# EAGLE design Hormiga_877_CH340G_Rev_C (EAGLE 9.6.2)

## Sheet 1 of 2: Main Board
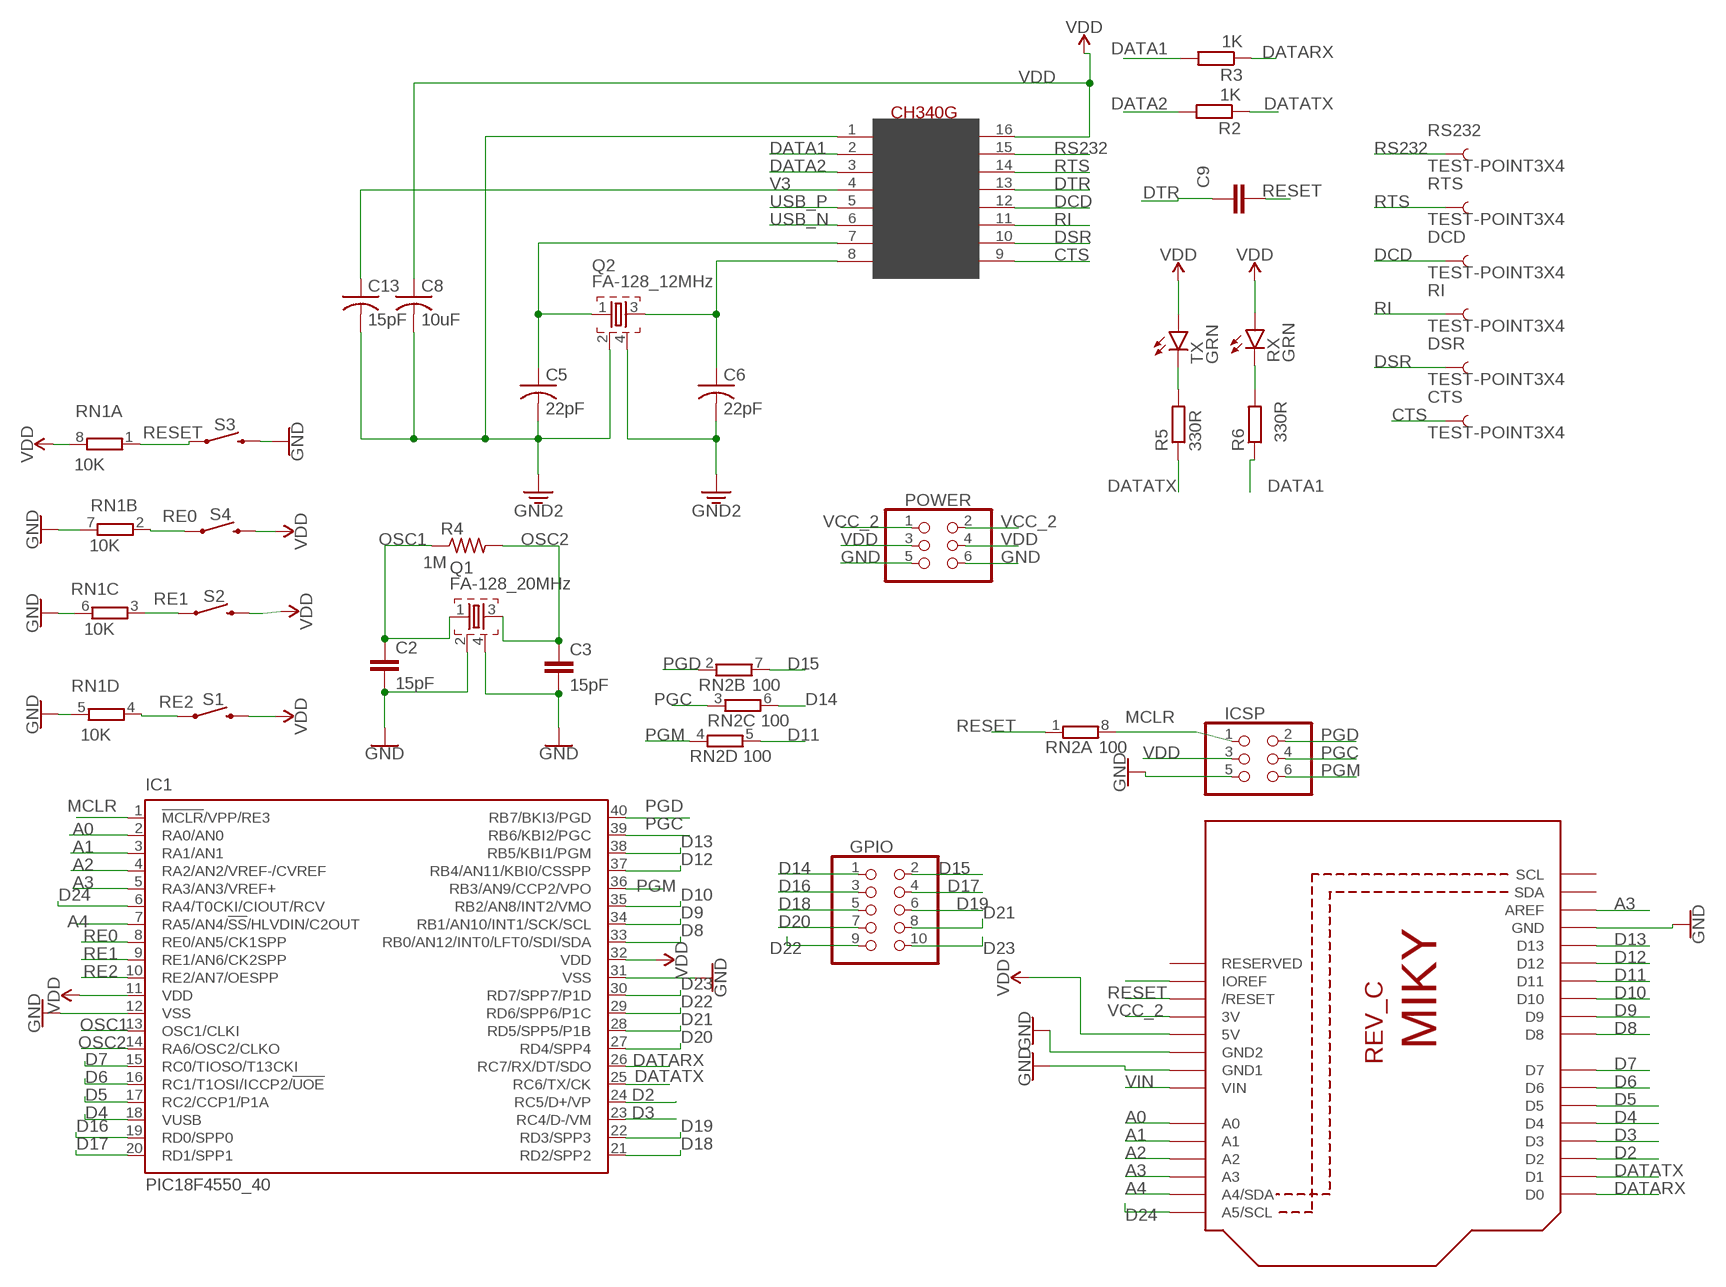
[diagram p0: schematic, sheet 1]

### Parts
C2  15pF  15PF-0402-50V-5%  [0402]
C3  15pF  15PF-0402-50V-5%  [0402]
C5  22pF  C-USC0603  [C0603]
C6  22pF  C-USC0603  [C0603]
C8  10uF  C-USC0603  [C0603]
C9  0.1uF  C-EUC0603  [C0603]
C13  15pF  C-USC0603  [C0603]
CTS  TEST-POINT3X4  [PAD.03X.04]
DCD  TEST-POINT3X4  [PAD.03X.04]
DSR  TEST-POINT3X4  [PAD.03X.04]
GPIO  PINHD-2X5  [2X05]
IC1  PIC18F4550_40  [DIL40]
ICSP  icsp  PINHD-2X3  [2X03]
POWER  POWER  PINHD-2X3  [2X03]
Q1  FA-128_20MHz  FA-128  [FA-128]
Q2  FA-128_12MHz  FA-128  [FA-128]
R2  1K  R-EU_R0805  [R0805]
R3  1K  R-EU_R0805  [R0805]
R4  1M  R-US_R0603  [R0603]
R5  330R  R-EU_R0805  [R0805]
R6  330R  R-EU_R0805  [R0805]
RI  TEST-POINT3X4  [PAD.03X.04]
RN1  10K  4R-N0603-ARC  [0603-ARC]
RN2  100  4R-N0603-ARC  [0603-ARC]
RS232  TEST-POINT3X4  [PAD.03X.04]
RTS  TEST-POINT3X4  [PAD.03X.04]
RX  GRN  LEDCHIP-LED0603  [CHIP-LED0603]
S1  MOMENTARY-SWITCH-SPST-SMD-5.2-REDUNDANT  [TACTILE_SWITCH_SMD_5.2MM]
S2  MOMENTARY-SWITCH-SPST-SMD-5.2-REDUNDANT  [TACTILE_SWITCH_SMD_5.2MM]
S3  MOMENTARY-SWITCH-SPST-SMD-5.2-REDUNDANT  [TACTILE_SWITCH_SMD_5.2MM]
S4  MOMENTARY-SWITCH-SPST-SMD-5.2-REDUNDANT  [TACTILE_SWITCH_SMD_5.2MM]
TX  GRN  LEDCHIP-LED0603  [CHIP-LED0603]
U2  ARDUINOR3-DIMENSION  [ARDUINOR3]
U$1  CH340G  [SOIC16]

### Nets
A0 [SIGNAL3V3]: IC1.2(RA0/AN0) U2.A0
A1 [SIGNAL3V3]: IC1.3(RA1/AN1) U2.A1
A2 [SIGNAL3V3]: IC1.4(RA2/AN2/VREF-/CVREF) U2.A2
A3 [SIGNAL3V3]: IC1.5(RA3/AN3/VREF+) U2.A3 U2.AREF
A4: IC1.7(RA5/AN4/!SS!/HLVDIN/C2OUT) U2.A4(A4/SDA)
CTS: CTS.P$1 U$1.9(CTS)
D2 [SIGNAL3V3]: IC1.24(RC5/D+/VP) U2.D2
D3 [SIGNAL3V3]: IC1.23(RC4/D-/VM) U2.D3
D4 [SIGNAL3V3]: IC1.18(VUSB) U2.D4
D5: IC1.17(RC2/CCP1/P1A) U2.D5
D6 [SIGNAL3V3]: IC1.16(RC1/T1OSI/ICCP2/!UOE) U2.D6
D7 [SIGNAL3V3]: IC1.15(RC0/TIOSO/T13CKI) U2.D7
D8: IC1.33(RB0/AN12/INT0/LFT0/SDI/SDA) U2.D8
D9: IC1.34(RB1/AN10/INT1/SCK/SCL) U2.D9
D10: IC1.35(RB2/AN8/INT2/VMO) U2.D10
D11: RN2.5 U2.D11
D12 [SIGNAL3V3]: IC1.37(RB4/AN11/KBI0/CSSPP) U2.D12
D13 [SIGNAL3V3]: IC1.38(RB5/KBI1/PGM) U2.D13 ; also sheet 2
D14 [SIGNAL3V3]: GPIO.1 RN2.6
D15 [SIGNAL3V3]: GPIO.2 RN2.7
D16: GPIO.3 IC1.19(RD0/SPP0)
D17 [SIGNAL3V3]: GPIO.4 IC1.20(RD1/SPP1)
D18: GPIO.5 IC1.21(RD2/SPP2)
D19 [SIGNAL3V3]: GPIO.6 IC1.22(RD3/SPP3)
D20 [SIGNAL3V3]: GPIO.7 IC1.27(RD4/SPP4)
D21 [SIGNAL3V3]: GPIO.8 IC1.28(RD5/SPP5/P1B)
D22 [SIGNAL3V3]: GPIO.9 IC1.29(RD6/SPP6/P1C)
D23: GPIO.10 IC1.30(RD7/SPP7/P1D)
D24 [SIGNAL3V3]: IC1.6(RA4/T0CKI/CIOUT/RCV) U2.A5(A5/SCL)
DATA1: R3.2 R6.1 U$1.2(TX)
DATA2: R2.2 U$1.3(RX)
DATARX [SIGNAL3V3]: IC1.26(RC7/RX/DT/SDO) R3.1 U2.D0
DATATX [SIGNAL3V3]: IC1.25(RC6/TX/CK) R2.1 R5.1 U2.D1
DCD: DCD.P$1 U$1.12(DCD)
DSR: DSR.P$1 U$1.10(DSR)
DTR: C9.1 U$1.13(DTR)
GND [SIGNALPIC]: C2.2 C3.2 C5.2 C6.2 C8.2 C13.2 IC1.12(VSS) IC1.31(VSS) ICSP.5 POWER.5 POWER.6 Q1.2 Q1.4 Q2.2 Q2.4 RN1.5 RN1.6 RN1.7 S3.3 S3.4 U2.GND U2.GND1 U2.GND2 U$1.1(GND) ; supply symbol labelled GND2 ; also sheet 2
LEDRX: R6.2 RX.C
LEDTX: R5.2 TX.C
MCLR: IC1.1(!MCLR!/VPP/RE3) ICSP.1 RN2.8
N$6: U2.IOREF
OSC1 [SIGNAL3V3]: C2.1 IC1.13(OSC1/CLKI) Q1.1 R4.1
OSC2 [SIGNAL3V3]: C3.1 IC1.14(RA6/OSC2/CLKO) Q1.3 R4.2
PGC [SIGNAL3V3]: IC1.39(RB6/KBI2/PGC) ICSP.4 RN2.3
PGD [SIGNAL3V3]: IC1.40(RB7/BKI3/PGD) ICSP.2 RN2.2
PGM: IC1.36(RB3/AN9/CCP2/VPO) ICSP.6 RN2.4
RE0: IC1.8(RE0/AN5/CK1SPP) RN1.2 S4.1 S4.2
RE1: IC1.9(RE1/AN6/CK2SPP) RN1.3 S2.1 S2.2
RE2: IC1.10(RE2/AN7/OESPP) RN1.4 S1.1 S1.2
RESET [SIGNAL3V3]: C9.2 RN1.1 RN2.1 S3.1 S3.2 U2.RESET(/RESET)
RI: RI.P$1 U$1.11(RI)
RS232: RS232.P$1 U$1.15(RS232)
RTS: RTS.P$1 U$1.14(RTS)
USB_N: U$1.6(D-) ; also sheet 2
USB_P: U$1.5(D+) ; also sheet 2
V3: C13.1 U$1.4(V3)
VCC_2 [SIGNAL3V3]: POWER.1 POWER.2 U2.3V ; also sheet 2
VDD: C8.1 IC1.11(VDD) IC1.32(VDD) ICSP.3 POWER.3 POWER.4 RN1.8 RX.A S1.3 S1.4 S2.3 S2.4 S4.3 S4.4 TX.A U2.5V U$1.16(VCC) ; also sheet 2
VIN [SIGNAL3V3]: U2.VIN ; also sheet 2
XI: C5.1 Q2.1 U$1.7(XI)
XO: C6.1 Q2.3 U$1.8(XO)
Unconnected: U2.RESERVED U2.SCL U2.SDA

## Sheet 2 of 2: Power_Supply
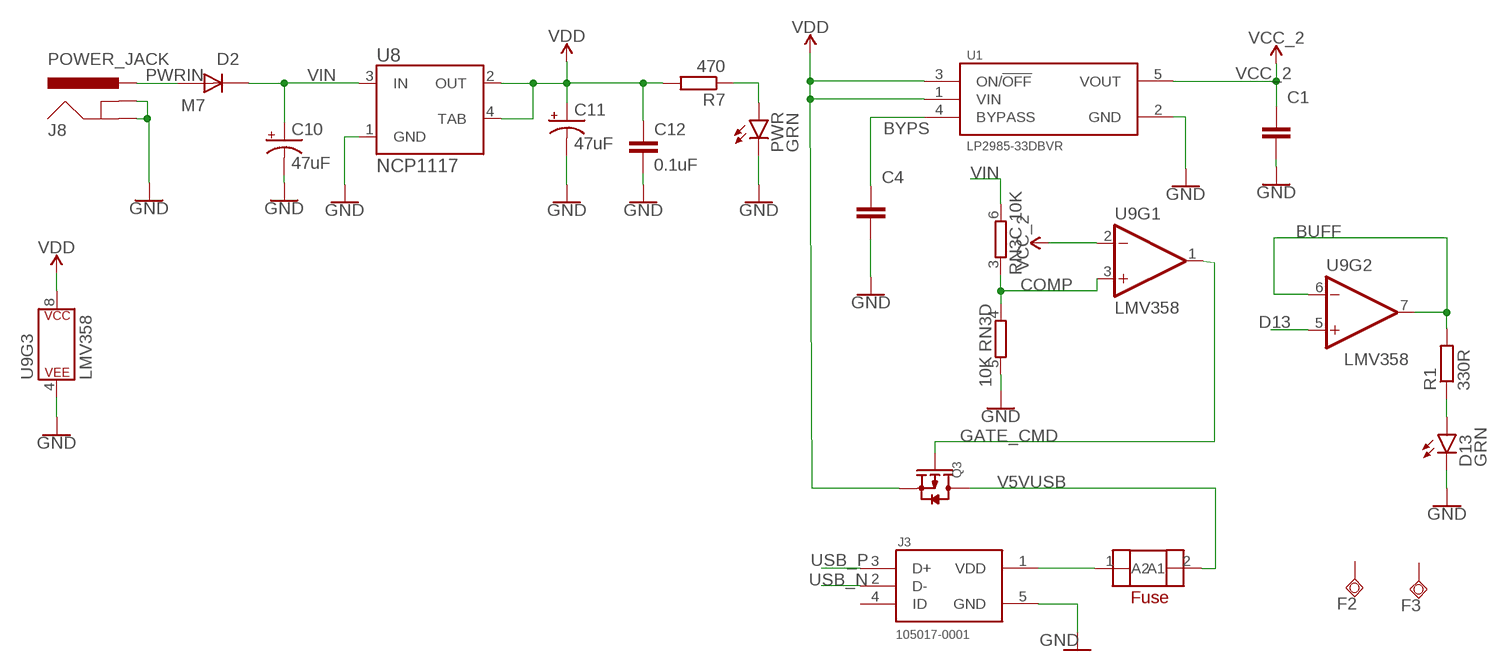
[diagram p1: schematic, sheet 2]

### Parts
C1  1.0uF  C-EUC0603  [C0603]
C4  10nF  C-EUC0603  [C0603]
C10  47uF  47UF-POLAR-PANASONIC_D-35V-20%  [PANASONIC_D]
C11  47uF  47UF-POLAR-PANASONIC_D-35V-20%  [PANASONIC_D]
C12  0.1uF  0.1UF-0402-16V-10%  [0402]
D2  M7  [DIOM505270X240]
D13  GRN  LEDCHIP-LED0603  [CHIP-LED0603]
F2  TPSQTP10R  [TP10R]
F3  TPSQTP10R  [TP10R]
FUSE  FUSE0603  [R0603]
J3  105017-0001  [MOLEX_105017-0001]
J8  POWER_JACK  [POWER_JACK_PTH]
PWR  GRN  LEDCHIP-LED0603  [CHIP-LED0603]
Q3  SMD-MOSFET-P-CH-20V-2A(SOT-23)  [SOT-23]
R1  330R  R-EU_R0805  [R0805]
R7  470  R-EU_R0805  [R0805]
RN3  10K  4R-N0603-ARC  [0603-ARC]
U1  LP2985-33DBVR  [SOT95P280X145-5N]
U8  NCP1117  [SOT223]
U9  LMV358  LMV358SOIC  [SO08]

### Nets
BUFF [SIGNAL3V3]: R1.2 U9.6(-IN) U9.7(OUT)
BYPS: C4.1 U1.4(BYPASS)
COMP: RN3.3 RN3.4 U9.3(+IN)
D13 [SIGNAL3V3]: U9.5(+IN) ; also sheet 1
D13LED [SIGNALPIC]: D13.A R1.1
FUSE: FUSE.1(A1) J3.1(VDD)
GATE_CMD [SIGNAL]: Q3.1(G) U9.1(OUT)
GND [SIGNALPIC]: C1.2 C4.2 C10.- C11.- C12.2 D13.C J3.5(GND) J8.GND J8.GNDBREAK PWR.C RN3.5 U1.2(GND) U8.1(GND) U9.4(P$V-) ; also sheet 1
ONLED [SIGNALPIC]: PWR.A R7.1
PWRIN [SIGNALPIC]: D2.A J8.PWR
USB_N: J3.2(D-) ; also sheet 1
USB_P: J3.3(D+) ; also sheet 1
V5VUSB: FUSE.2(A2) Q3.3(D)
VCC_2 [SIGNAL3V3]: C1.1 U1.5(VOUT) U9.2(-IN) ; also sheet 1
VDD: C11.+ C12.1 Q3.2(S) R7.2 U1.1(VIN) U1.3(ON/!OFF) U8.2(OUT) U8.4(TAB) U9.8(P$V+) ; also sheet 1
VIN [SIGNAL3V3]: C10.+ D2.C RN3.6 U8.3(IN) ; also sheet 1
Unconnected: F2.TP F3.TP J3.4(ID) RN3.1 RN3.2 RN3.7 RN3.8

## Library data of the parts
C1 = rcl:C-EU: CAPACITOR, European symbol; MPN: C1608X5R1E105K080AC; OC_NEWARK: 90R7677; SPICEPREFIX: C
C2 C3 = SparkFun-Capacitors:15PF: 15pF ceramic capacitors A capacitor is a passive two-terminal electrical component used to store electrical energy temporarily in an electric field.; MF: FARNELL; MPN: CC0402JRNPO9BN150; OC_NEWARK: 69C9582; PROD_ID: CAP-13063
C4 = rcl:C-EU: CAPACITOR, European symbol; MPN: C0603C103K1RACTU; OC_NEWARK: 29T8974; SPICEPREFIX: C
C5 C6 C8 C13 = rcl:C-US: CAPACITOR, American symbol; SPICEPREFIX: C
C9 = rcl:C-EU: CAPACITOR, European symbol; MPN: C0603C103J1RACTU; OC_NEWARK: 07X0751; SPICEPREFIX: C
C10 C11 = SparkFun-Capacitors:47UF-POLAR: 47µF polarized capacitors A capacitor is a passive two-terminal electrical component used to store electrical energy temporarily in an electric field.; MPN: EEE-1CA470WR; OC_NEWARK: 53W3779; PROD_ID: CAP-08478
C12 = SparkFun-Capacitors:0.1UF: 0.1µF ceramic capacitors A capacitor is a passive two-terminal electrical component used to store electrical energy temporarily in an electric field.; MPN: C0603C103J1RACTU; OC_NEWARK: 07X0751; PROD_ID: CAP-12416
CTS DCD DSR RI RS232 RTS = SparkFun-Connectors:TEST-POINT: SparkFun Test Points Bare copper test points for troubleshooting or In-Circuit-Testing. These are used by our Production team for verifying production board runs using pogo-pins on test beds. SparkFun Products: SparkFun LSM9DS1 Breakout <https://www.sparkfun.com/products/13284> SparkFun PSOC <https://www.sparkfun.com/products/13714> SparkFun Load Cell Amplifier <https://www.sparkfun.com/products/13879>
D2 = Tonche_Library:M7: none; AVAILABILITY: Unavailable; MP: M7; MPN: RFN1LAM7STFTR; OC_NEWARK: 58AC3694; PACKAGE: DO-214 Diodes Inc.; PRICE: 0.01 USD
D13 PWR RX TX = led:LED: LED OSRAM: - CHIPLED LG R971, LG N971, LY N971, LG Q971, LY Q971, LO R971, LY R971 LH N974, LH R974 LS Q976, LO Q976, LY Q976 LO Q996 - Hyper CHIPLED LW Q18S LB Q993, LB Q99A, LB R99A - SideLED LS A670, LO A670, LY A670, LG A670, LP A670 LB A673, LV A673, LT A673, LW A673 LH A674 LY A675 LS A676, LA A676, LO A676, LY A676, LW A676 LS A679, LY A679, LG A679 - Hyper Micro SIDELED® LS Y876, LA Y876, LO Y876, LY Y876 LT Y87S - SmartLED LW L88C, LW L88S LB L89C, LB L89S, LG L890 LS L89K, LO L89K, LY L89K LS L896, LA L896, LO L896, LY L896 - TOPLED LS T670, LO T670, LY T670, LG T670, LP T670 LSG T670, LSP T670, LSY T670, LOP T670, LYG T670 LG T671, LOG T671, LSG T671 LB T673, LV T673, LT T673, LW T673 LH T674 LS T676, LA T676, LO T676, LY T676, LB T676, LH T676, LSB T676, LW T676 LB T67C, LV T67C, LT T67C, LS T67K, LO T67K, LY T67K, LW E67C LS E67B, LA E67B, LO E67B, LY E67B, LB E67C, LV E67C, LT E67C LW T67C LS T679, LY T679, LG T679 LS T770, LO T770, LY T770, LG T770, LP T770 LB T773, LV T773, LT T773, LW T773 LH T774 LS E675, LA E675, LY E675, LS T675 LS T776, LA T776, LO T776, LY T776, LB T776 LHGB T686 LT T68C, LB T68C - Hyper Mini TOPLED® LB M676 - Mini TOPLED Santana® LG M470 LS M47K, LO M47K, LY M47K Source: http://www.osram.convergy.de LUXEON: - LUMILED® LXK2-PW12-R00, LXK2-PW12-S00, LXK2-PW14-U00, LXK2-PW14-V00 LXK2-PM12-R00, LXK2-PM12-S00, LXK2-PM14-U00 LXK2-PE12-Q00, LXK2-PE12-R00, LXK2-PE12-S00, LXK2-PE14-T00, LXK2-PE14-U00 LXK2-PB12-K00, LXK2-PB12-L00, LXK2-PB12-M00, LXK2-PB14-N00, LXK2-PB14-P00, LXK2-PB14-Q00 LXK2-PR12-L00, LXK2-PR12-M00, LXK2-PR14-Q00, LXK2-PR14-R00 LXK2-PD12-Q00, LXK2-PD12-R00, LXK2-PD12-S00 LXK2-PH12-R00, LXK2-PH12-S00 LXK2-PL12-P00, LXK2-PL12-Q00, LXK2-PL12-R00 Source: www.luxeon.com KINGBRIGHT: KA-3528ASYC Source: www.kingbright.com; MPN: HSME-C191; OC_NEWARK: 05M0345
F2 F3 = testpad:TPSQ: Test pad
FUSE = Tonche_Library:FUSE0603
GPIO = pinhead:PINHD-2X5: PIN HEADER
IC1 = microchip:PIC18F4*_40: USB Microcontrollers with nanoWatt Technology High-Performance, Enhanced Flash, 28/40/44-Pin, Source: http://ww1.microchip.com/downloads/en/devicedoc/39632c.pdf; MF: MICROCHIP; MPN: PIC18F4550-I/P; OC_FARNELL: 9321357; OC_NEWARK: 74K8623
ICSP POWER = pinhead:PINHD-2X3: PIN HEADER
J3 = MICRO-B_MOLEX_105017-0001:105017-0001; AVAILABILITY: Unavailable; DESCRIPTION: Conn USB Type B M 5 POS 0.65mm Solder RA Thru-Hole 5 Terminal 1 Port Embossed T/R; MF: Molex; MP: 105017-0001; PACKAGE: None; PRICE: None
J8 = SparkFun-Connectors:POWER_JACK: Power Jack Connector This is the standard 5.5mm barrel jack for power. The PTH is the most common, proven, reliable, footprint. The Slot footprint only works if the mill layer is transmitted to the PCB fab house so be warned. Here are the connectors we sell at SparkFun: DC Barrel Power Jack/Connector <https://www.sparkfun.com/products/119> (PRT-00119) DC Barrel Power Jack/Connector (SMD) <https://www.sparkfun.com/products/12748> (PRT-12748) DC Barrel Jack Adapter - Breadboard Compatible <https://www.sparkfun.com/products/10811> (PRT-10811) It is used on this SparkFun product (and many, many others): SparkFun RedBoard - Programmed with Arduino <https://www.sparkfun.com/products/12757> (DEV-12757) Also, if you need a mating power supply or connector, please check these out: Wall Adapter Power Supply - 9VDC 650mA <https://www.sparkfun.com/products/298> (TOL-00298) DC Barrel Jack Adapter - Male <https://www.sparkfun.com/products/10287> (PRT-10287); MPN: FC681465P; OC_NEWARK: 20T2054; PROD_ID: CONN-08197
Q1 Q2 = crystal:FA-: MHz RANGE CRYSTAL UNIT Source: Epson Toyocom
Q3 = SMD-MOSFET-P-CH-20V-2A_SOT-23_:SMD-MOSFET-P-CH-20V-2A(SOT-23): 305030026; AVAILABILITY: Good; DESCRIPTION: Single P-Channel 20V 70 mOhm Logic Level PowerTrench Mosfet SSOT-3; MF: FAIRCHILD SEMICONDUCTOR; MP: FDN340P; MPN: FDN340P; OC_NEWARK: 58K8841; PACKAGE: SC-59 ON Semiconductor; PRICE: 0.19 USD
R1 R5 R6 = rcl:R-EU_: RESISTOR, European symbol; MPN: ERJ-6GEYJ331V; OC_NEWARK: 65T8817; SPICEPREFIX: R
R2 R3 = rcl:R-EU_: RESISTOR, European symbol; MPN: EXB-V8V103JV; OC_NEWARK: 65T8998; SPICEPREFIX: R
R4 = Arduino Modificable_2:R-US_: RESISTOR, American symbol
R7 = rcl:R-EU_: RESISTOR, European symbol; MPN: ERJ-6GEYJ471V; OC_NEWARK: 65T8826; SPICEPREFIX: R
RN1 RN3 = resistor-dil:4R-N: Array Chip Resistor Source: RS Component / Phycomp; MPN: EXB-V8V103JV; OC_FARNELL: unknown; OC_NEWARK: 65T8998
RN2 = resistor-dil:4R-N: Array Chip Resistor Source: RS Component / Phycomp; OC_FARNELL: unknown; OC_NEWARK: unknown
S1-S4 = SparkFun-Switches:MOMENTARY-SWITCH-SPST: Momentary Switch (Pushbutton) - SPST Normally-open (NO) SPST momentary switches (buttons, pushbuttons). Variants PTH-12MM - 12mm square, through-hole Momentary Pushbutton Switch - 12mm Square <https://www.sparkfun.com/products/9190> (COM-09190) PTH-6.0MM, PTH-6.0MM-KIT - 6.0mm square, through-hole Mini Pushbutton Switch <https://www.sparkfun.com/products/97> (COM-00097) KIT package intended for soldering kit's - only one side of pads' copper is exposed. PTH-RIGHT-ANGLE-KIT - Right-angle, through-hole Right Angle Tactile Button <https://www.sparkfun.com/products/10791> - Used on SparkFun BigTime Watch Kit <https://www.sparkfun.com/products/11734> SMD-12MM - 12mm square, surface-mount Tactile Button - SMD (12mm) <https://www.sparkfun.com/products/12993> (COM-12993) Used on SparkFun PicoBoard <https://www.sparkfun.com/products/11888> SMD-4.5MM - 4.5mm Square Trackball Switch Used on SparkFun Blackberry Trackballer Breakout <https://www.sparkfun.com/products/13169> SMD-4.6MMX2.8MM - 4.60mm x 2.80mm, surface mount Used on SparkFun SAMD21 Mini Breakout <https://www.sparkfun.com/products/13664> SMD-5.2MM, SMD-5.2-REDUNDANT - 5.2mm square, surface-mount Mini Pushbutton Switch - SMD <https://www.sparkfun.com/products/8720> (COM-08720) Used on Arduino Pro Mini <https://www.sparkfun.com/products/11114> REDUNDANT package connects both switch circuits together SMD-6.0X3.5MM - 6.0 x 3.5mm, surface mount Momentary Reset Switch SMD <https://www.sparkfun.com/products/8229> (COM-08229) SMD-6.2MM-TALL - 6.2mm square, surface mount Tactile Button - SMD (6mm) <https://www.sparkfun.com/products/12992> Used on SparkFun Digital Sandbox <https://www.sparkfun.com/products/12651> SMD-RIGHT-ANGLE - Right-angle, surface mount Used on SparkFun Block for Intel® Edison - Arduino <https://www.sparkfun.com/products/13036>; MPN: TL3301AF160QG; OC_NEWARK: 15N4497; PROD_ID: SWCH-08247; SF_SKU: COM-08720
U1 = LP2985-33DBVR:LP2985-33DBVR: LP2985 150-mA Low-noise Low-dropout Regulator With Shutdown; AVAILABILITY: Good; DESCRIPTION: Single Output LDO, 150mA, Fixed_3.3V_, 1.5% Tolerance, Low Quiescent Current, Low Noise 5-SOT-23 -40 to 125; MF: TEXAS INSTRUMENTS; MP: LP2985-33DBVR; MPN: LP2985-33DBVR; OC_NEWARK: 43J9346; PACKAGE: SOT-23-5 Texas Instruments; PRICE: 0.39 USD
U2 = Arduino Modificable_2:ARDUINOR3: This is a new object for the new Arduino R3 - with extra pins that you may want to use (such as IOref, and duplicated A4/A5
U8 = NCP1117:NCP1117: Check availability <https://pricing.snapeda.com/parts/NCP1117/ON%20Semiconductor/view-part?ref=eda>; AVAILABILITY: In Stock; DESCRIPTION: Linear Voltage Regulator IC Positive Fixed 1 Output 1A SOT-223; MF: ON SEMICONDUCTOR; MP: NCP1117; MPN: NCP1117ST50T3G; OC_NEWARK: 71J6563; PACKAGE: None; PRICE: None
U9 = SparkFun-IC-Amplifiers:LMV358: IC LMV358 DUAL OP AMP Jellybean rail-to-rail output op-amp SparkFun Products SparkFun PicoBoard <https://www.sparkfun.com/products/11888> (WIG-11888) SparkFun Vernier Interface Shield <https://www.sparkfun.com/products/12858> (DEV-12858) SparkFun Blynk Board - ESP8266 <https://www.sparkfun.com/products/13794> (WRL-13794) SparkFun Digital Sandbox <https://www.sparkfun.com/products/12651> (DEV-12651 RoHS); MF: FAIRCHILD SEMICONDUCTOR; MPN: LMV358AM8X; OC_NEWARK: 29H0537; PROD_ID: IC-09657
U$1 = CH340G:CH340G: Check availability <https://pricing.snapeda.com/parts/CH340G/Olimex/view-part?ref=eda>; AVAILABILITY: Not in stock; DESCRIPTION: IC-340 USB INTERFACE SO16; MF: Olimex; MP: CH340G; PACKAGE: None; PRICE: None

## Net classes
0 USBUART: width 0.3 mm, clearance 0.1 mm
1 SIGNAL: width 0.53 mm, clearance 0.3 mm
2 3V3: width 0.35 mm, clearance 0.006 mm
3 SIGNALPIC: width 0.53 mm, clearance 0.008 mm
4 SIGNAL3V3: width 0.35 mm, clearance 0.15 mm
5 LEDUSART: width 0.1 mm, clearance 0.003 mm

## Board
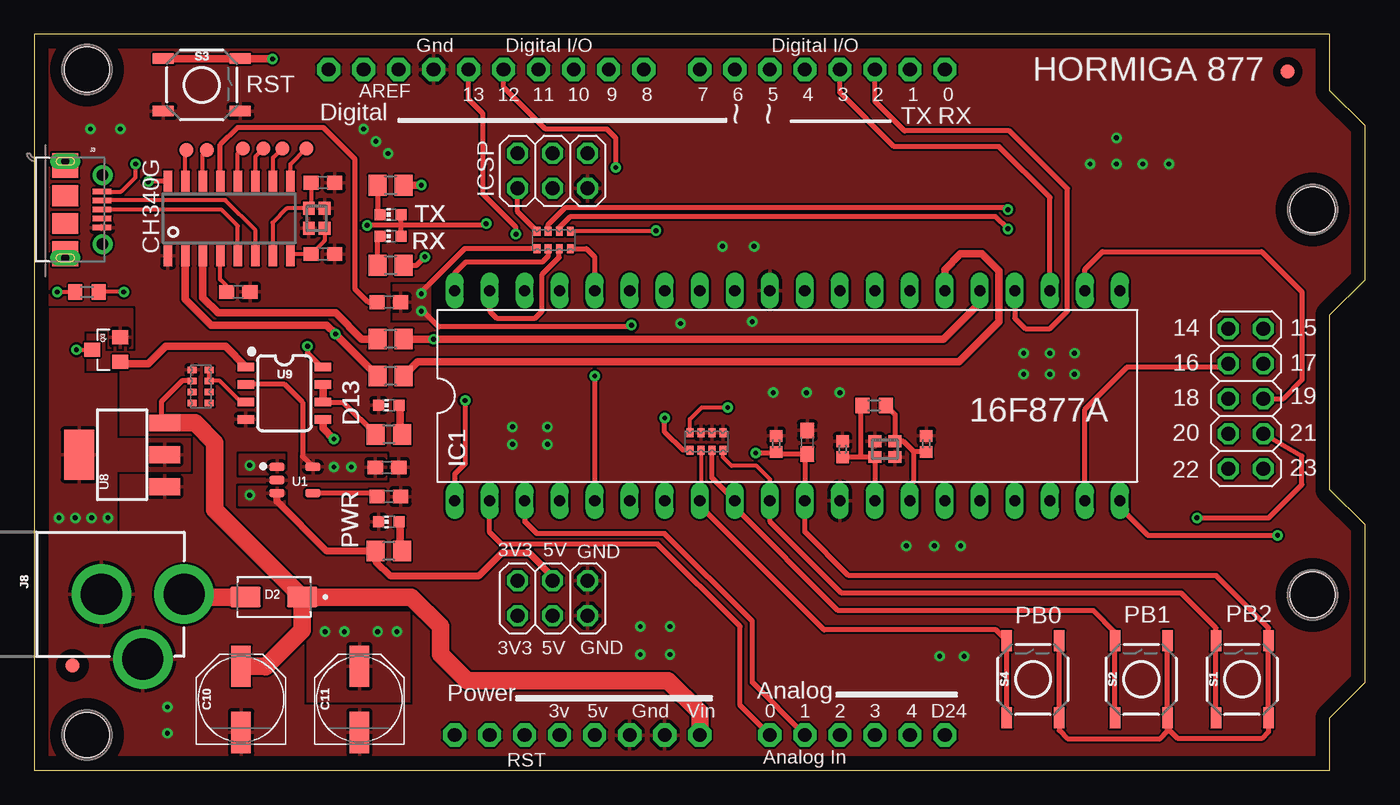
[diagram p2: board, top side]
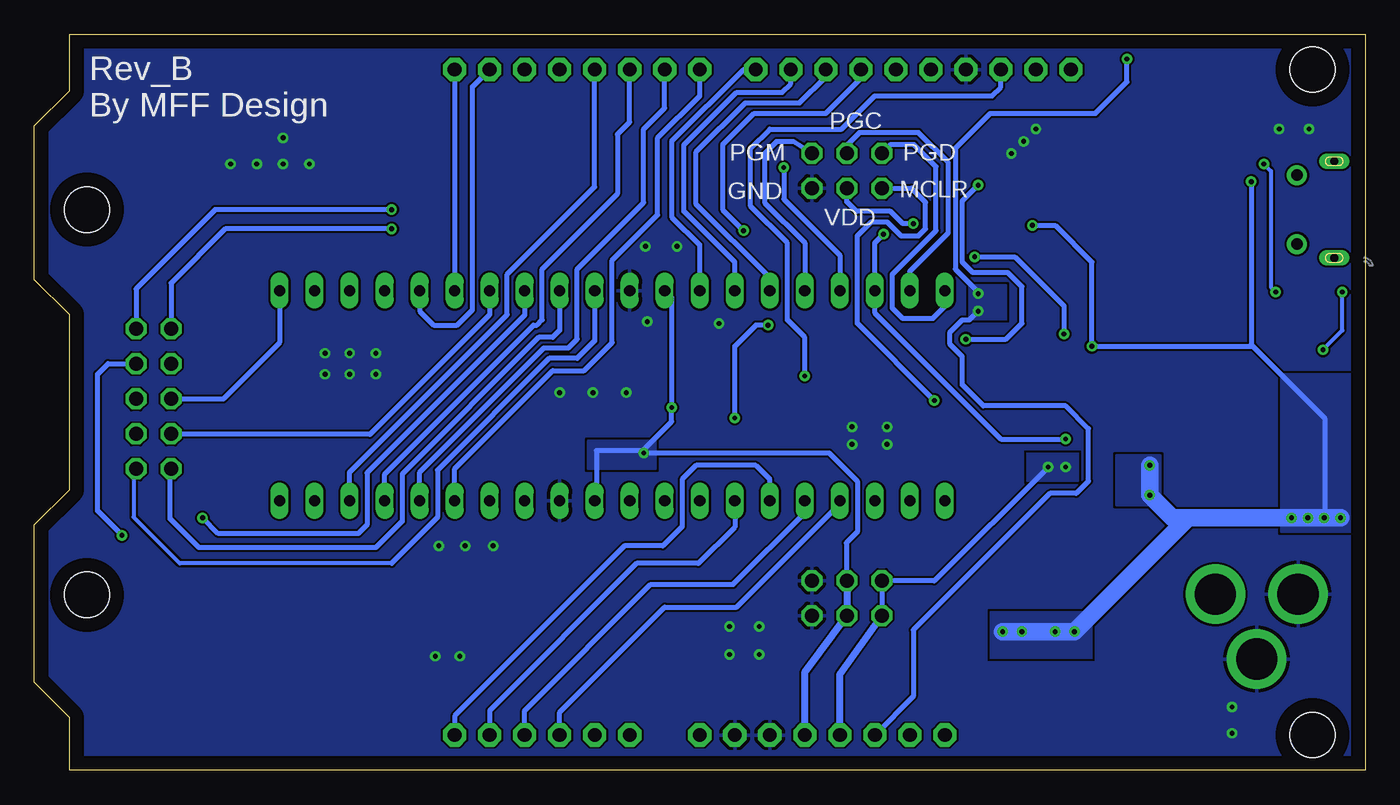
[diagram p3: board, bottom side, seen from below]

Size 96.52 x 53.34 mm. Coordinates in mm from the lower left corner, seen from the top.
Outline: 0,0 93.98,0 93.98,3.81 96.52,6.35 96.52,17.78 93.98,20.32 93.98,33.02 96.52,35.56 96.52,46.74 93.98,49.28 93.98,53.34 0,53.34 0,0
Copper layers (1*16): Top 0.035mm / dielectric 1.5mm / Bottom 0.035mm
Design rules "default": minimum track width 6mil, minimum drill 0.35mm, track to track 6mil, track to pad 6mil, pad to pad 6mil, via to via 6mil, smd to smd 6mil, copper to edge 40mil, drill to drill 6mil, minimum pad ring 10mil, minimum via ring 8mil, stop-mask expansion 4mil, vias tented up to drill 0mil, thermal gap 10mil
tRestrict: area 1.8,6.7 to 3.7,8.5; area 90.1,49.9 to 91.7,51.4

### Footprints (pad centres in the part's own frame; a part is rotated, then mirrored left to right if it is on the bottom)
C0603 = smd 1.1 x 1: 1 -0.85,0; 2 0.85,0
0402 = smd 0.85 x 0.9: 1 -0.58,0; 2 0.58,0
PANASONIC_D = smd 3 x 1.4: + 2.4,0; - -2.4,0
PAD.03X.04 = smd 1.016 x 1.016: P$1 0,0
DIOM505270X240 = smd 2.21 x 1.53: A 2.05,0; C -2.05,0
CHIP-LED0603 = smd 0.8 x 0.8: A 0,-0.75; C 0,0.75
TP10R = smd 1 x 1: TP 0,0
R0603 = smd 1 x 1.1: 1 -0.85,0; 2 0.85,0
2X05 = drill 1.016 octagon: 1 -5.08,-1.27; 2 -5.08,1.27; 3 -2.54,-1.27; 4 -2.54,1.27; 5 0,-1.27; 6 0,1.27; 7 2.54,-1.27; 8 2.54,1.27; 9 5.08,-1.27; 10 5.08,1.27
DIL40 = drill 0.813 long: 1 -24.13,-7.62; 2 -21.59,-7.62; 3 -19.05,-7.62; 4 -16.51,-7.62; 5 -13.97,-7.62; 6 -11.43,-7.62; 7 -8.89,-7.62; 8 -6.35,-7.62; 9 -3.81,-7.62; 10 -1.27,-7.62; 11 1.27,-7.62; 12 3.81,-7.62; 13 6.35,-7.62; 14 8.89,-7.62; 15 11.43,-7.62; 16 13.97,-7.62; 17 16.51,-7.62; 18 19.05,-7.62; 19 21.59,-7.62; 20 24.13,-7.62; 21 24.13,7.62; 22 21.59,7.62; 23 19.05,7.62; 24 16.51,7.62; 25 13.97,7.62; 26 11.43,7.62; 27 8.89,7.62; 28 6.35,7.62; 29 3.81,7.62; 30 1.27,7.62; 31 -1.27,7.62; 32 -3.81,7.62; 33 -6.35,7.62; 34 -8.89,7.62; 35 -11.43,7.62; 36 -13.97,7.62; 37 -16.51,7.62; 38 -19.05,7.62; 39 -21.59,7.62; 40 -24.13,7.62
2X03 = drill 1.016 octagon: 1 -2.54,-1.27; 2 -2.54,1.27; 3 0,-1.27; 4 0,1.27; 5 2.54,-1.27; 6 2.54,1.27
MOLEX_105017-0001 = smd 0.4 x 1.35: 1 -1.3,2.675; 2 -0.65,2.675; 3 0,2.675; 4 0.65,2.675; 5 1.3,2.675 | drill 0.85 pad 1.45: P$1 -2.5,2.7; P$2 2.5,2.7 | smd 1.5 x 1.9: P$8 -1,0; P$9 1,0 | smd 1.8 x 1.9: P$10 -3.2,0; P$11 3.2,0 | drill 0.6 pad 0.8 long: P$12 -3.5,0; P$13 3.5,0
POWER_JACK_PTH = drill 2.997 pad 4.318: GND 0,7.7; GNDBREAK 4.7,10.7; PWR 0,13.7
FA-128 = smd 0.95 x 0.85: 1 -0.725,-0.575; 2 0.725,-0.575; 3 0.725,0.575; 4 -0.725,0.575
SOT-23 = smd 1.016 x 1.143: 1 -0.889,-1.016; 2 0.889,-1.016; 3 0,1.016
R0805 = smd 1.3 x 1.5: 1 -0.95,0; 2 0.95,0
0603-ARC = smd 0.5 x 0.65: 1 -1.2,-0.625; 2 -0.4,-0.625; 3 0.4,-0.625; 4 1.2,-0.625; 5 1.2,0.625; 6 0.4,0.625; 7 -0.4,0.625; 8 -1.2,0.625
TACTILE_SWITCH_SMD_5.2MM = smd 1.524 x 0.762: 1 -2.794,1.905; 2 2.794,1.905; 3 -2.794,-1.905; 4 2.794,-1.905
SOT95P280X145-5N = smd 1.1 x 0.6: 1 -1.3,0.95; 2 -1.3,0; 3 -1.3,-0.95; 4 1.3,-0.95; 5 1.3,0.95
ARDUINOR3 = drill 1 pad 1.676 octagon: 3V 38.1,2.54; 5V 40.64,2.54; A0 53.34,2.54; A1 55.88,2.54; A2 58.42,2.54; A3 60.96,2.54; A4 63.5,2.54; A5 66.04,2.54; AREF 26.416,50.8; D0 66.04,50.8; D1 63.5,50.8; D2 60.96,50.8; D3 58.42,50.8; D4 55.88,50.8; D5 53.34,50.8; D6 50.8,50.8; D7 48.26,50.8; D8 44.196,50.8; D9 41.656,50.8; D10 39.116,50.8; D11 36.576,50.8; D12 34.036,50.8; D13 31.496,50.8; GND 28.956,50.8; GND1 45.72,2.54; GND2 43.18,2.54; IOREF 33.02,2.54; RESERVED 30.48,2.54; RESET 35.56,2.54; SCL 21.336,50.8; SDA 23.876,50.8; VIN 48.26,2.54 | hole 3.302: 3.81,50.8; 3.81,2.54; 92.71,12.7; 92.71,40.64
SOT223 = smd 1.219 x 2.235: 1 -2.311,-3.099; 2 0,-3.099; 3 2.311,-3.099 | smd 3.6 x 2.2: 4 0,3.099
SO08 = smd 0.6 x 1.2: 1 -1.905,-2.8; 2 -0.635,-2.8; 3 0.635,-2.8; 4 1.905,-2.8; 5 1.905,2.8; 6 0.635,2.8; 7 -0.635,2.8; 8 -1.905,2.8
SOIC16 = smd 0.635 x 1.524: 1 -4.445,-2.695; 2 -3.175,-2.695; 3 -1.905,-2.695; 4 -0.635,-2.695; 5 0.635,-2.695; 6 1.905,-2.695; 7 3.175,-2.695; 8 4.445,-2.695; 9 4.445,2.695; 10 3.175,2.695; 11 1.905,2.695; 12 0.635,2.695; 13 -0.635,2.695; 14 -1.905,2.695; 15 -3.175,2.695; 16 -4.445,2.695

### Placement (x,y rotation side)
C1  25.58,21.94 0 top
C2  58.62,23.27 90 top
C3  64.69,23.65 90 top
C4  25.7,19.83 0 top
C5  20.92,42.6 0 top
C6  20.92,37.41 0 top
C8  56.06,23.77 90 top
C9  25.7,33.93 0 top
C10  14.99,5.13 90 top
C11  23.57,5.13 90 top
C12  53.8,23.65 90 top
C13  14.78,34.67 0 top
CTS  19.71,45.09 0 top
D2  17.37,12.55 180 top
D13  25.7,26.45 90 top
DCD  15.13,45.09 0 top
DSR  17.97,45.09 0 top
F2  2.74,7.57 0 top
F3  90.91,50.65 0 top
FUSE  3.81,34.67 180 top
GPIO  87.88,26.92 270 top
IC1  54.61,27.15 0 top
ICSP  37.59,43.46 0 top
J3  2.24,40.64 270 top
J8  -2.84,12.75 270 top
POWER  37.59,12.47 0 top
PWR  25.7,17.99 90 top
Q1  61.7,23.27 0 top
Q2  20.47,40.01 270 top
Q3  5.2,30.48 90 top
R1  25.7,24.33 180 top
R2  25.83,31.25 180 top
R3  25.83,28.57 180 top
R4  60.91,26.44 0 top
R5  25.83,42.4 180 top
R6  25.83,36.6 180 top
R7  25.7,15.88 180 top
RI  16.62,45.09 0 top
RN1  48.74,23.83 0 top
RN2  37.67,38.43 0 top
RN3  12.06,27.81 90 top
RS232  11.02,44.96 0 top
RTS  12.51,44.96 0 top
RX  25.83,38.72 90 top
S1  87.6,6.58 90 top
S2  80.29,6.58 90 top
S3  12.14,49.68 0 top
S4  72.44,6.58 90 top
TX  25.83,40.28 90 top
U1  18.9,21.03 0 top
U2  0,0 0 top
U8  6.35,22.86 90 top
U9  18.14,27.33 270 top
U$1  14.12,40.01 0 top

### Tracks (layer width: path | path; a pad name or v marks a point on that pad's centre or on a via)
A0
  Top 0.35: U2.A0 51.18,4.7 51.18,10.41 45.21,16.38 33.88,16.38 33.02,17.24 IC1.2
A1
  Top 0.35: U2.A1 52.07,6.35 52.07,10.79 45.72,17.14 36.45,17.14 35.56,18.03 IC1.3
A2
  Bottom 0.35: U2.A2 58.42,4.19 50.8,11.81 45.59,11.81 38.1,19.3 IC1.4
A3  (via drill 0.35)
  Top 0.35: v40.64,28.57 IC1.5
  Bottom 0.35: U2.A3 60.96,4.32 51.82,13.46 45.85,13.46 40.64,18.67 IC1.5 | v40.64,28.57 40.64,31.37 41.91,32.64 41.91,38.23 44.58,40.89 44.58,45.09 43.18,46.48 37.97,46.48 35.56,48.9 27.05,48.9 26.42,49.53 U2.AREF
A4
  Bottom 0.35: U2.A4 63.5,4.32 52.83,14.99 48.35,14.99 45.72,17.62 IC1.7
BUFF
  Top 0.35: R1.2 22.48,26.61 22.48,26.62 21.01,26.62 U9.6
  Top 0.53: U9.6 U9.7
BYPS
  Top 0.35: C4.1 24.77,19.83 24.52,20.08 U1.4
COMP
  Top 0.3: RN3.4 RN3.3 13.44,28.21 14.96,26.7 U9.3
CTS
  Top 0.3: U$1.9 18.57,43.94 CTS.P$1
D2
  Top 0.35: IC1.24 71.12,32.77 71.88,32 73.66,32 74.93,33.27 74.93,42.16 70.74,46.35 63.12,46.35 60.96,48.51 U2.D2
D3
  Top 0.35: IC1.23 73.66,41.53 69.98,45.21 62.36,45.21 58.42,49.15 U2.D3
D4
  Bottom 0.35: IC1.18 73.66,21.59 62.23,33.02 62.23,35.94 55.88,42.29 U2.D4
D5
  Bottom 0.35: IC1.17 71.12,21.46 60.33,32.26 60.07,32.26 59.69,32.64 59.69,36.32 54.23,41.78 54.23,46.1 53.34,46.99 U2.D5
D6
  Bottom 0.35: IC1.16 68.58,21.59 59.56,30.61 57.78,30.61 57.15,31.24 57.15,36.32 52.32,41.15 52.32,46.48 50.8,48.01 U2.D6
D7
  Bottom 0.35: IC1.15 66.04,21.84 58.93,28.96 56.64,28.96 54.61,30.99 54.61,36.96 51.31,40.26 51.31,45.85 48.26,48.9 U2.D7
D8
  Bottom 0.35: IC1.33 48.26,38.07 50.29,40.1 50.29,45.59 45.09,50.8 U2.D8
D9
  Bottom 0.35: IC1.34 45.72,36.83 49.4,40.51 49.4,45.34 45.59,49.15 42.29,49.15 41.66,49.78 U2.D9
D10
  Bottom 0.35: IC1.35 43.18,35.69 48.51,41.02 48.51,44.83 44.96,48.39 41.02,48.39 39.12,50.29 U2.D10
D11  (via drill 0.35)
  Top 0.305: v45.09,39.12 45.02,39.05 RN2.5
  Bottom 0.35: v45.09,39.12 46.61,40.64 46.61,45.34 44.32,47.62 39.12,47.62 36.58,50.16 U2.D11
D12  (via drill 0.35)
  Top 0.35: U2.D12 34.04,49.53 37.08,46.48 41.53,46.48 42.16,45.85 v42.16,43.69
  Bottom 0.35: v42.16,43.69 42.16,41.4 38.1,37.34 IC1.37
D13  (via drill 0.35)
  Top 0.35: v34.92,38.86 34.92,39.37 32.51,41.78 32.51,47.62 31.5,48.64 U2.D13
  Top 0.53: v21.72,24 20.94,24.78 U9.5
  Bottom 0.35: v21.72,24 26.42,24 35.54,33.13 35.54,34.75 IC1.38 35.56,38.23 v34.92,38.86
D13LED
  Top 0.53: R1.1 26.53,24.46 26.53,26.38 D13.A
D14  (via drill 0.35)
  Top 0.35: RN2.6 38.07,39.34 38.86,40.13 69.72,40.13 v70.61,39.24
  Bottom 0.35: v70.61,39.24 82.68,39.24 86.61,35.31 GPIO.1
D15  (via drill 0.35)
  Top 0.35: RN2.7 37.27,39.55 38.48,40.77 70.48,40.77 v70.61,40.64
  Bottom 0.35: v70.61,40.64 83.41,40.64 89.15,34.9 GPIO.2
D16
  Top 0.35: IC1.19 76.2,26.16 79.25,29.21 86.67,29.21 GPIO.3
D17  (via drill 0.35)
  Top 0.35: IC1.20 78.74,19.05 80.77,17.02 v90.17,17.02
  Bottom 0.35: v90.17,17.02 91.95,18.8 91.95,28.7 91.19,29.46 GPIO.4
D18
  Bottom 0.35: IC1.21 78.74,30.99 82.8,26.92 GPIO.5
D19
  Top 0.35: IC1.22 76.2,36.32 77.47,37.59 89.03,37.59 91.95,34.67 91.95,28.3 90.58,26.92 GPIO.6
D20
  Bottom 0.35: IC1.27 63.5,33.02 72.19,24.34 86.63,24.34 arc-90 GPIO.7
D21  (via drill 0.35)
  Top 0.35: v84.33,18.29 89.53,18.29 91.95,20.7 91.95,22.76 GPIO.8
  Bottom 0.35: v84.33,18.29 83.19,17.14 73.03,17.14 72.39,17.78 72.39,21.56 60.96,32.99 IC1.28
D22
  Bottom 0.35: GPIO.9 86.7,21.51 86.7,18.25 84.58,16.13 71.75,16.13 69.85,18.03 69.85,21.46 59.94,31.37 58.93,31.37 58.42,31.88 IC1.29
D23
  Bottom 0.3: 70.61,14.99 85.98,14.99 89.33,18.34 89.33,21.18 GPIO.10
  Bottom 0.35: IC1.30 55.88,31.11 57.15,29.84 59.18,29.84 67.28,21.75 67.28,18.32 70.61,14.99
D24
  Bottom 0.35: IC1.6 43.18,21.08 44.2,22.1 48.51,22.1 49.53,21.08 49.53,17.65 50.93,16.26 53.72,16.26 66.04,3.94 U2.A5
DATA1  (via drill 0.35)
  Top 0.35: R6.1 27.71,36.6 v28.32,37.21
  Top 0.53: U$1.2 10.95,34.14 12.83,32.26 21.21,32.26 v21.84,31.62 v21.84,31.61 R3.2
  Bottom 0.35: v28.32,37.21 25.4,37.21 21.84,33.66 v21.84,31.62
DATA2
  Top 0.53: R2.2 23.74,31.25 21.84,33.15 13.34,33.15 12.22,34.27 U$1.3
DATARX
  Top 0.53: IC1.26 66.04,36.29 67.18,37.43 68.74,37.43 69.98,36.2 69.98,32.51 67.06,29.59 30.35,29.59 27.8,29.59 R3.1
  Bottom 0.35: U2.D0 IC1.26
DATATX  (via drill 0.35)
  Top 0.53: IC1.25 68.58,33.88 65.94,31.24 v28.96,31.24 v28.95,31.25 R2.1 | R5.1 28.05,42.4 v28.07,42.42
  Bottom 0.35: IC1.25 68.58,33.27 67.56,32.26 65.86,32.26 64.74,33.38 64.74,49.56 U2.D1 | v28.96,31.24 26.04,31.24 24.89,32.38 24.89,35.05 25.91,36.07 28.45,36.07 29.21,36.83 29.21,41.27 v28.07,42.42
DCD
  Top 0.3: U$1.12 14.76,44.71 DCD.P$1
DSR
  Top 0.3: U$1.10 17.3,44.41 DSR.P$1
DTR
  Top 0.35: U$1.13 13.49,45.36 14.73,46.61 20.95,46.61 23.24,44.32 23.24,34.9 24.22,33.92 C9.1
FUSE  (via drill 0.35)
  Top 0.3: J3.1 6.28,41.94 7.34,43 v7.34,43.94 | v6.48,34.67 FUSE.1
  Bottom 0.3: v7.34,43.94 6.83,43.43 6.83,35.03 v6.48,34.67
GATE_CMD
  Top 0.53: U9.1 13.85,30.72 9.51,30.72 8.26,29.46 6.34,29.46 Q3.1
GND  (via drill 0.35)
  other vias: 76.58,43.94 78.49,43.94 80.39,43.94 82.3,43.94 49.91,37.97 52.2,37.97 78.49,45.85 73.66,30.23 75.44,28.7 75.44,30.23 73.66,28.7 71.75,30.23 71.75,28.7 53.59,27.37 56.01,27.37 58.42,27.37 37.21,24.89 46.86,32.38 52.07,32.51 34.67,23.62 37.21,23.62 34.67,24.89 4.06,46.48 6.22,46.48 24.77,45.59 23.88,46.48 25.65,44.7 9.65,2.67 9.65,4.57 65.66,8.26 67.44,8.26 63.25,16.26 65.28,16.26 67.18,16.26 43.94,10.41 46.1,10.41 43.94,8.38 46.1,8.38
  pour Top (rank 2): 0,53.34 0,-0.13 96.9,-0.13 96.9,53.34
  pour Bottom (rank 2): 0,53.34 0,-0.13 97.03,-0.13 97.03,53.34
LEDRX
  Top 0.35: R6.2 24.88,38.52 RX.C
LEDTX
  Top 0.35: R5.2 24.88,40.48 TX.C
MCLR  (via drill 0.35)
  Top 0.35: v31.24,26.8 31.24,22.23 30.48,21.46 IC1.1 | ICSP.1 35.05,40.47 RN2.8
  Bottom 0.35: v31.24,26.8 36.83,32.38 36.83,38.73 35.81,39.75 34.67,39.75 33.66,38.73 32.38,38.73 31.88,39.24 31.88,41.17 32.89,42.19 ICSP.1
ONLED
  Top 0.53: R7.1 26.53,16 26.53,17.92 PWR.A
OSC1
  Top 0.35: 59.94,22.69 C2.1 | 59.94,22.69 Q1.1 60.97,19.53 IC1.13 | 59.94,22.69 59.94,26.33 R4.1
OSC2
  Top 0.35: C3.1 63.8,23.07 | 63.8,23.07 63.75,23.07 63.75,20.92 63.5,20.67 IC1.14 | 63.8,23.07 63.03,23.84 Q1.3 62.42,25.78 R4.2
PGC
  Top 0.35: IC1.39 33.02,33.27 33.53,32.77 36.32,32.77 36.83,33.27 36.83,35.94 38.07,37.18 RN2.3
  Bottom 0.35: ICSP.4 37.59,45.31 36.68,46.23 32.38,46.23 30.23,44.07 30.23,38.96 33.02,36.16 IC1.39
PGD
  Top 0.35: RN2.2 37.27,37.27 36.83,36.83 31.27,36.83 30.48,36.04 IC1.40
  Bottom 0.35: IC1.40 30.48,33.62 31.37,32.73 33.53,32.73 34.29,33.5 34.29,35.94 31.11,39.12 31.11,43.76 32.71,45.36 34.42,45.36 ICSP.2
PGM
  Top 0.35: RN2.4 40.05,37.8 40.64,37.21 IC1.36
  Bottom 0.35: ICSP.6 41.5,45.59 42.67,45.59 43.56,44.7 43.56,41.15 40.64,38.23 IC1.36
PWRIN
  Top 1.27: D2.A 11.06,12.55 J8.PWR
RE0
  Top 0.3: RN1.2 48.34,19.61 IC1.8
  Top 0.35: IC1.8 48.26,19.18 57.28,10.16 69.75,10.16 S4.2 S4.1
RE1
  Top 0.35: S2.1 S2.2 78.38,10.01 76.83,11.56 58.29,11.56 50.8,19.05 IC1.9 49.14,21.18 RN1.3
RE2
  Top 0.3: IC1.10 53.37,19.53 53.37,21.08 52.39,22.06 50.58,22.06 49.94,22.69 RN1.4
  Top 0.35: S1.1 S1.2 85.7,10.31 83.19,12.83 58.55,12.83 53.37,18.01 53.37,19.53
RESET  (via drill 0.35)
  Top 0.35: RN2.1 31.2,37.8 28.07,34.67 v28.07,34.54 | v43.31,32.26 43.19,32.14 29.33,32.14 28.19,33.27 v28.07,33.27 | RN1.1 47.03,23.2 45.72,24.51 v45.72,25.53
  Top 0.53: S3.1 S3.2 17.25,51.59 v17.27,51.56
  Bottom 0.35: v45.72,25.53 45.72,30.73 44.2,32.26 v43.31,32.26 | U2.RESET 32.77,5.33 32.77,10.16 22.86,20.07 20.95,20.07 20.07,20.95 20.07,24.77 21.72,26.42 27.69,26.42 29.21,27.94 29.21,29.97 30.1,30.86 30.1,31.75 29.21,32.64 28.7,32.64 v28.07,33.27 | v28.07,34.54 28.07,34.67 29.72,36.32 29.72,45.09 27.18,47.62 19.56,47.62 17.27,49.91 v17.27,51.56
  pour Top: 26.04,32.64 26.04,35.18 28.7,35.18 28.7,32.64
  pour Bottom: 28.7,35.18 26.04,35.18 26.04,32.64 28.7,32.64
RI
  Top 0.3: U$1.11 16.03,44.5 RI.P$1
RS232
  Top 0.3: U$1.15 10.95,44.88 RS232.P$1
RTS
  Top 0.3: U$1.14 12.22,44.67 RTS.P$1
USB_N
  Top 0.3: U$1.6 16.03,39.13 13.84,41.32 4.94,41.32 J3.2
USB_P
  Top 0.3: U$1.5 14.76,39.46 13.6,40.62 4.88,40.62 J3.3
V3
  Top 0.3: C13.1 13.93,35.12 13.46,35.59 13.46,37.28 U$1.4
V5VUSB  (via drill 0.35)
  Top 0.3: v3.05,30.48 Q3.3 | v1.65,34.67 FUSE.2
  Bottom 0.3: v3.05,30.48 1.65,31.88 v1.65,34.67
VCC_2  (via drill 0.35)
  Top 0.35: U1.5 19.44,22.74 19.44,26.67 18.14,27.96 U9.2
  Bottom 0.35: v22.99,21.97 31.24,13.72 35.03,13.72 POWER.2 POWER.1
  Bottom 0.508: U2.3V 38.1,6.93 POWER.1
  other vias: 21.72,21.97
  pour Top: 19.3,21.08 25.53,21.08 25.53,22.86 19.3,22.86
  pour Bottom: 20.83,22.99 20.83,20.95 24.51,20.95 24.51,22.99
VDD  (via drill 0.35)
  Top 0.3: v50.29,26.29 48.39,26.29 47.54,25.45 RN1.8
  Top 0.35: U9.8 20.8,29.23 19.81,30.23 v19.81,30.73 | RX.A 26.58,39.5 | 26.58,39.5 TX.A | 26.58,39.5 v24.13,39.5 | U$1.16 8.28,42.7 v8.26,42.67 | S2.4 S2.3 82.19,3.05 | S4.4 S4.3 74.35,2.87 74.93,2.29 81.66,2.29 82.19,2.82 82.19,3.05 | v52.32,22.99 53.72,22.99 C12.1 53.94,22.92 C8.1 55.88,22.92 IC1.11 55.88,17.27 59.05,14.1 85.72,14.1 89.51,10.31 S1.4 S1.3 89.51,2.77 89.03,2.29 82.96,2.29 82.19,3.05 | v32.77,39.62 32.64,39.5 26.58,39.5
  Top 0.508: U1.3 17.6,19.49 21.21,15.88 R7.2 24.75,15.12 25.78,14.1 32.26,14.1 33.91,15.75 35.87,15.75 37.73,13.88 POWER.4
  Bottom 0.35: 8.13,30.73 v19.81,30.73 19.81,36.83 22.48,39.5 v24.13,39.5 | 2.92,18.29 2.92,25.53 8.13,30.73 | v8.26,42.67 8.26,30.86 8.13,30.73 | v52.32,22.99 52.32,23.24 50.29,25.27 v50.29,26.29 50.29,34.26 IC1.32 | v52.32,22.99 52.52,23.18 55.75,23.18 55.75,19.65 IC1.11 | v52.32,22.99 38.86,22.99 36.83,20.95 36.83,17.27 37.63,16.47 37.63,13.78 POWER.4 | v32.77,39.62 33.53,39.62 34.42,40.51 36.88,40.51 37.6,41.23 37.59,41.29 ICSP.3
  Bottom 0.508: POWER.4 POWER.3 40.64,7.09 U2.5V
  Bottom 1.27: v26.29,10.03 v21.08,10.03 12.83,18.29 | 12.83,18.29 13.97,18.29 v15.62,19.94 v15.62,22.1 | 12.83,18.29 v5.33,18.29 2.92,18.29 v1.78,18.29
  other vias: 2.96,18.29 4.15,18.29 22.48,10.03 24.89,10.03
  pour Top: 5.97,17.4 5.97,21.72 11.3,21.72 11.3,24 5.97,24 5.97,28.7 3.56,28.7 3.56,31.88 5.33,31.88 5.33,30.61 7.11,30.61 7.11,33.4 0.64,33.4 0.64,17.4
  pour Top: 27.18,4.95 19.81,4.95 19.81,11.43 27.18,11.43
  pour Bottom: 5.97,17.27 1.02,17.27 1.02,28.7 6.1,28.7 6.1,17.27
  pour Top: 18.16,21.46 18.16,22.86 14.86,22.86 14.86,21.46
  pour Bottom: 18.03,19.18 18.03,22.86 14.86,22.86 14.86,19.43 15.11,19.18
  pour Bottom: 27.18,8.13 19.81,8.13 19.81,11.43 27.18,11.43
  pour Top: 14.86,20.57 18.16,20.57 18.16,19.18 14.86,19.18
  pour Bottom: 56.39,21.84 51.44,21.84 51.44,23.88 56.39,23.88
VIN
  Top 0.35: RN3.6 11.41,28.24 10.72,28.24 9.2,26.71 9.2,25.43 U8.3
  Top 1.27: D2.C 19.42,10.15 16.76,7.49 16.73,7.53 C10.+ | D2.C 13.08,18.89 13.08,23.75 11.66,25.17 U8.3 | D2.C 27.33,12.55 29.46,10.41 29.46,8.38 31.37,6.48 45.97,6.48 48.26,4.19 U2.VIN
XI
  Top 0.3: C5.1 20.07,40.9 Q2.1 18.3,40.73 17.27,39.7 17.27,37.34 U$1.7
XO
  Top 0.3: Q2.3 21.05,38.39 C6.1 18.67,37.41 U$1.8

### Text on the board
tNames: HORMIGA 877 | RST | Digital | ~ | ~ | TX | RX | ICSP | 14 | 15 | 16 | 17 | 19 | 18 | 16F877A | 20 | 21 | 22 | 23 | 3V3 | 5V | GND | PB0 | PB1 | PB2 | 3V3 | 5V | GND | Power | Analog | 4 | D24
bNames: Rev_B / By MFF Design | PGC | PGD | PGM | MCLR | GND | VDD
_tNames: S3 | S3 | S3 | S3 | J3 | J3 | J3 | J3 | TX | TX | TX | TX | RX | RX | RX | RX | Q3 | Q3 | Q3 | Q3 | U9 | U9 | U9 | U9 | D13 | D13 | D13 | D13 | IC1 | IC1 | IC1 | IC1 | U1 | U1 | U1 | U1 | U8 | U8 | U8 | U8 | PWR | PWR | PWR | PWR | J8 | J8 | J8 | J8 | D2 | D2 | D2 | D2 | S4 | S4 | S4 | S4 | S2 | S2 | S2 | S2 | S1 | S1 | S1 | S1 | C10 | C10 | C10 | C10 | C11 | C11 | C11 | C11